# EAGLE schematic ApplicationShield (EAGLE 7.3.0)
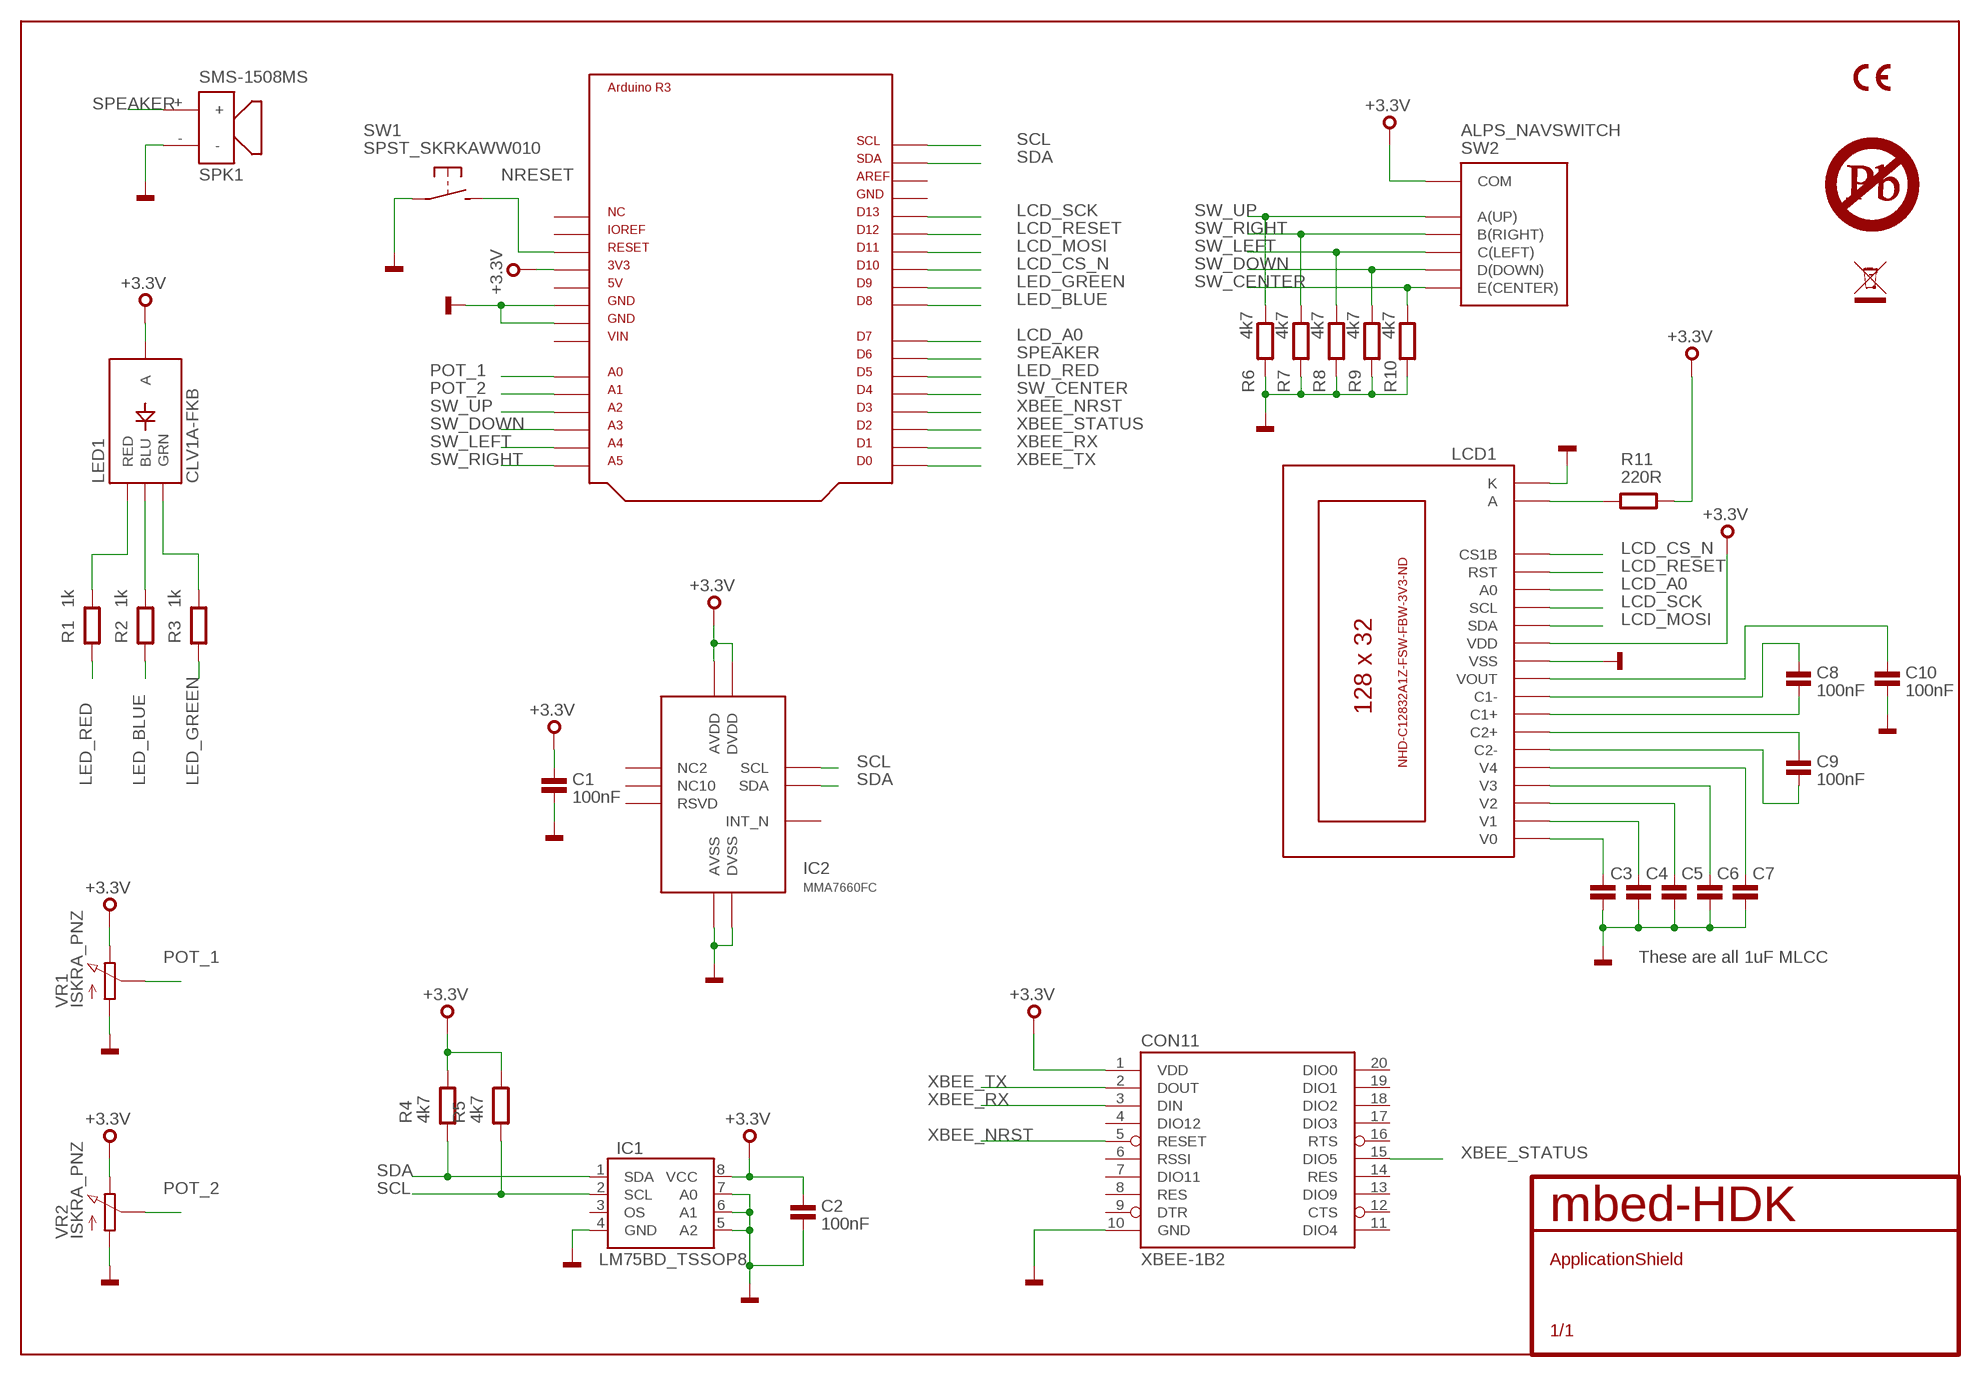
[diagram p0: schematic, sheet 1]

## Parts
BRD1  ARDUINO_R3_APPS  [ARDUINO_R3_APPS_SHEILD]
C1  100nF  C0402  [0402]
C2  100nF  C0402  [0402]
C3  100nF  C0402  [0402]
C4  100nF  C0402  [0402]
C5  100nF  C0402  [0402]
C6  100nF  C0402  [0402]
C7  100nF  C0402  [0402]
C8  100nF  C0402  [0402]
C9  100nF  C0402  [0402]
C10  100nF  C0402  [0402]
CON11  XBEE-1B2  [XBEE-SILK]
IC1  LM75BD_TSSOP8  [TSSOP8]
IC2  MMA7660FC  [DFN10-3X3MM]
LCD1  C12832A1Z  [C12832A1Z]
LED1  CLV1A-FKB  [PLCC-4]
R1  1k  R0402  [0402]
R2  1k  R0402  [0402]
R3  1k  R0402  [0402]
R4  4k7  R0402  [0402]
R5  4k7  R0402  [0402]
R6  4k7  R0402  [0402]
R7  4k7  R0402  [0402]
R8  4k7  R0402  [0402]
R9  4k7  R0402  [0402]
R10  4k7  R0402  [0402]
R11  220R  R0402  [0402]
SPK1  SMS-1508MS  [SMS-1508MS-R]
SS1  PB-MARK  [PB-MARK-0.2]
SS2  CE-MARK  [CE-MARK-0.2]
SS3  WEEE-MARK  [WEEE-MARK-0.2]
SW1  SPST_SKRKAWW010  [SKRKAEE010]
SW2  ALPS_NAVSWITCH  [SKRHA_SERIES]
VR1  ISKRA_PNZ  [CA14V]
VR2  ISKRA_PNZ  [CA14V]

## Nets
+3.3V: BRD1.P$4 C1.1 C2.1 CON11.1(VDD) IC1.8(VCC) IC2.P$3(AVDD) IC2.P$9(DVDD) LCD1.P$12(VDD) LED1.2(A) R4.2 R5.2 R11.1 SW2.P$5(COM) VR1.P$3(E) VR2.P$3(E)
GND: BRD1.P$6 BRD1.P$7 C1.2 C2.2 C3.2 C4.2 C5.2 C6.2 C7.2 C10.2 CON11.10(GND) IC1.4(GND) IC1.5(A2) IC1.6(A1) IC1.7(A0) IC2.P$4(AVSS) IC2.P$8(DVSS) LCD1.K LCD1.P$11(VSS) R6.2 R7.2 R8.2 R9.2 R10.2 SPK1.- SW1.P$1(P) VR1.P$1(A) VR2.P$1(A)
LCD_A0: BRD1.P$22 LCD1.P$15(A0)
LCD_CS_N: BRD1.P$25 LCD1.P$17(CS1B)
LCD_MOSI: BRD1.P$26 LCD1.P$13(SDA)
LCD_RESET: BRD1.P$27 LCD1.P$16(RST)
LCD_SCK: BRD1.P$28 LCD1.P$14(SCL)
LED_BLUE: BRD1.P$23 R2.1
LED_GREEN: BRD1.P$24 R3.1
LED_RED: BRD1.P$20 R1.1
N$1: LCD1.A R11.2
N$7: C8.1 LCD1.P$9(C1-)
N$8: C8.2 LCD1.P$8(C1+)
N$9: C9.1 LCD1.P$7(C2+)
N$10: C9.2 LCD1.P$6(C2-)
N$11: C3.1 LCD1.P$1(V0)
N$12: C4.1 LCD1.P$2(V1)
N$14: C5.1 LCD1.P$3(V2)
N$15: C6.1 LCD1.P$4(V3)
N$16: C7.1 LCD1.P$5(V4)
N$17: LED1.1(RED) R1.2
N$18: C10.1 LCD1.P$10(VOUT)
N$19: LED1.4(GRN) R3.2
N$20: LED1.3(BLU) R2.2
NRESET: BRD1.P$3 SW1.P$2(S)
POT_1: BRD1.P$9 VR1.P$2(S)
POT_2: BRD1.P$10 VR2.P$2(S)
SCL: BRD1.P$32 IC1.2(SCL) IC2.P$6(SCL) R5.1
SDA: BRD1.P$31 IC1.1(SDA) IC2.P$7(SDA) R4.1
SPEAKER: BRD1.P$21 SPK1.+
SW_CENTER: BRD1.P$19 R10.1 SW2.P$2(E(CENTER))
SW_DOWN: BRD1.P$12 R9.1 SW2.P$4(D(DOWN))
SW_LEFT: BRD1.P$13 R8.1 SW2.P$1(C(LEFT))
SW_RIGHT: BRD1.P$14 R7.1 SW2.P$6(B(RIGHT))
SW_UP: BRD1.P$11 R6.1 SW2.P$3(A(UP))
XBEE_NRST: BRD1.P$18 CON11.5(RESET)
XBEE_RX: BRD1.P$16 CON11.3(DIN)
XBEE_STATUS: BRD1.P$17 CON11.15(DIO5)
XBEE_TX: BRD1.P$15 CON11.2(DOUT)
Unconnected: BRD1.P$1 BRD1.P$2 BRD1.P$5 BRD1.P$8 BRD1.P$29 BRD1.P$30 CON11.4(DIO12) CON11.6(RSSI) CON11.7(DIO11) CON11.8(RES) CON11.9(DTR) CON11.11(DIO4) CON11.12(CTS) CON11.13(DIO9) CON11.14(RES) CON11.16(RTS) CON11.17(DIO3) CON11.18(DIO2) CON11.19(DIO1) CON11.20(DIO0) IC1.3(OS) IC2.P$1(RSVD) IC2.P$2(NC2) IC2.P$5(INT_N) IC2.P$10(NC10)

## Notes on the sheet
- These are all 1uF MLCC

## Library data of the parts
BRD1 = ApplicationShield:ARDUINO_R3
C1-C10 = mbed-HDK:C: Capacitor
CON11 = ApplicationShield:XBEE-1
IC1 = ApplicationShield:LM75BD
IC2 = ApplicationShield:MMA7660FC
LCD1 = ApplicationShield:C12832A1Z
LED1 = ApplicationShield:CLV1A-FKB: Tri-Color LED SMD Proven layout and schematic for triple color LED in SMD package - common anode. Spark Fun Electronics SKU : COM-07844
R1-R11 = mbed-HDK:R
SPK1 = ApplicationShield:SMS-1508MS
SS1 = ApplicationShield:PB-MARK
SS2 = ApplicationShield:CE-MARK
SS3 = ApplicationShield:WEEE-MARK
SW1 = mbed-HDK:SPST
SW2 = ApplicationShield:ALPS_NAVSWITCH
VR1 VR2 = ApplicationShield:ISKRA_PNZ